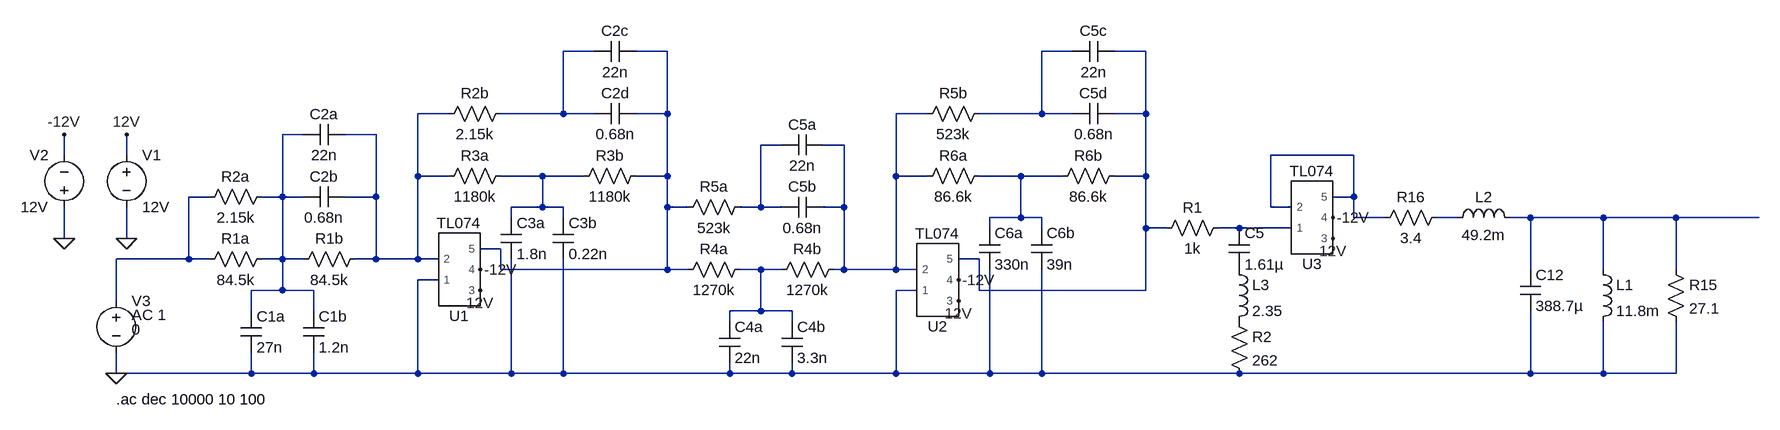
[diagram p0: schematic dual_full_lt_pyle_notch_tl074.asc]
dual_full_lt_pyle_notch_tl074.asc, the LTspice schematic file:
Version 4
SHEET 1 1284 1184
WIRE -688 224 -736 224
WIRE -576 224 -624 224
WIRE 48 224 0 224
WIRE 160 224 112 224
WIRE -912 320 -960 320
WIRE -736 320 -736 224
WIRE -736 320 -832 320
WIRE -688 320 -736 320
WIRE -576 320 -576 224
WIRE -576 320 -624 320
WIRE -176 320 -224 320
WIRE 0 320 0 224
WIRE 0 320 -96 320
WIRE 48 320 0 320
WIRE 160 320 160 224
WIRE 160 320 112 320
WIRE -1136 352 -1168 352
WIRE -1024 352 -1072 352
WIRE -400 368 -432 368
WIRE -304 368 -336 368
WIRE -1504 384 -1504 352
WIRE -1408 384 -1408 352
WIRE 480 384 352 384
WIRE -960 416 -960 320
WIRE -912 416 -960 416
WIRE -768 416 -832 416
WIRE -704 416 -768 416
WIRE -576 416 -576 320
WIRE -576 416 -624 416
WIRE -224 416 -224 320
WIRE -176 416 -224 416
WIRE -32 416 -96 416
WIRE 32 416 -32 416
WIRE 160 416 160 320
WIRE 160 416 112 416
WIRE -1280 448 -1312 448
WIRE -1168 448 -1168 352
WIRE -1168 448 -1200 448
WIRE -1136 448 -1168 448
WIRE -1024 448 -1024 352
WIRE -1024 448 -1072 448
WIRE 480 448 480 384
WIRE 480 448 448 448
WIRE -768 464 -768 416
WIRE -768 464 -816 464
WIRE -736 464 -768 464
WIRE -576 464 -576 416
WIRE -544 464 -576 464
WIRE -432 464 -432 368
WIRE -432 464 -464 464
WIRE -400 464 -432 464
WIRE -304 464 -304 368
WIRE -304 464 -336 464
WIRE 352 464 352 384
WIRE 384 464 352 464
WIRE -816 480 -816 464
WIRE -736 480 -736 464
WIRE -32 480 -32 416
WIRE -32 480 -80 480
WIRE 0 480 -32 480
WIRE 480 480 480 448
WIRE 528 480 480 480
WIRE 640 480 608 480
WIRE 752 480 720 480
WIRE 864 480 752 480
WIRE 976 480 864 480
WIRE 1104 480 976 480
WIRE -80 496 -80 480
WIRE 0 496 0 480
WIRE 160 496 160 416
WIRE 192 496 160 496
WIRE 304 496 272 496
WIRE 384 496 304 496
WIRE -1504 512 -1504 464
WIRE -1408 512 -1408 464
WIRE -832 528 -864 528
WIRE -1312 544 -1312 448
WIRE -1312 544 -1424 544
WIRE -1280 544 -1312 544
WIRE -1168 544 -1168 448
WIRE -1168 544 -1200 544
WIRE -1136 544 -1168 544
WIRE -1024 544 -1024 448
WIRE -1024 544 -1056 544
WIRE -960 544 -960 416
WIRE -960 544 -1024 544
WIRE -928 544 -960 544
WIRE -96 544 -128 544
WIRE -832 560 -832 528
WIRE -576 560 -576 464
WIRE -576 560 -832 560
WIRE -544 560 -576 560
WIRE -432 560 -464 560
WIRE -400 560 -432 560
WIRE -304 560 -304 464
WIRE -304 560 -320 560
WIRE -224 560 -224 416
WIRE -224 560 -304 560
WIRE -192 560 -224 560
WIRE 752 560 752 480
WIRE 864 560 864 480
WIRE 976 560 976 480
WIRE -928 576 -960 576
WIRE -1168 592 -1168 544
WIRE -1168 592 -1216 592
WIRE -1120 592 -1168 592
WIRE -192 592 -224 592
WIRE -96 592 -96 544
WIRE 160 592 160 496
WIRE 160 592 -96 592
WIRE -1424 608 -1424 544
WIRE -1216 624 -1216 592
WIRE -1120 624 -1120 592
WIRE -432 624 -432 560
WIRE -432 624 -480 624
WIRE -384 624 -432 624
WIRE -480 640 -480 624
WIRE -384 640 -384 624
WIRE -1424 720 -1424 688
WIRE -1216 720 -1216 688
WIRE -1216 720 -1424 720
WIRE -1120 720 -1120 688
WIRE -1120 720 -1216 720
WIRE -960 720 -960 576
WIRE -960 720 -1120 720
WIRE -816 720 -816 544
WIRE -816 720 -960 720
WIRE -736 720 -736 544
WIRE -736 720 -816 720
WIRE -480 720 -480 704
WIRE -480 720 -736 720
WIRE -384 720 -384 704
WIRE -384 720 -480 720
WIRE -224 720 -224 592
WIRE -224 720 -384 720
WIRE -80 720 -80 560
WIRE -80 720 -224 720
WIRE 0 720 0 560
WIRE 0 720 -80 720
WIRE 304 720 0 720
WIRE 752 720 752 624
WIRE 752 720 304 720
WIRE 864 720 864 640
WIRE 864 720 752 720
WIRE 976 720 976 640
WIRE 976 720 864 720
FLAG -1424 720 0
FLAG -1408 352 12V
FLAG -1504 352 -12V
FLAG -1504 512 0
FLAG -1408 512 0
FLAG -864 592 12V
FLAG -864 560 -12V
FLAG -128 608 12V
FLAG -128 576 -12V
FLAG 448 512 12V
FLAG 448 480 -12V
SYMBOL res -1184 528 R90
WINDOW 0 0 56 VBottom 2
WINDOW 3 32 56 VTop 2
SYMATTR InstName R1a
SYMATTR Value 84.5k
SYMBOL res -1040 528 R90
WINDOW 0 0 56 VBottom 2
WINDOW 3 32 56 VTop 2
SYMATTR InstName R1b
SYMATTR Value 84.5k
SYMBOL res -1184 432 R90
WINDOW 0 0 56 VBottom 2
WINDOW 3 32 56 VTop 2
SYMATTR InstName R2a
SYMATTR Value 2.15k
SYMBOL cap -1072 432 R90
WINDOW 0 0 32 VBottom 2
WINDOW 3 32 32 VTop 2
SYMATTR InstName C2b
SYMATTR Value 0.68n
SYMBOL cap -1232 624 R0
SYMATTR InstName C1a
SYMATTR Value 27n
SYMBOL res -816 400 R90
WINDOW 0 0 56 VBottom 2
WINDOW 3 32 56 VTop 2
SYMATTR InstName R3a
SYMATTR Value 1180k
SYMBOL cap -832 480 R0
SYMATTR InstName C3a
SYMATTR Value 1.8n
SYMBOL res -608 400 R90
WINDOW 0 0 56 VBottom 2
WINDOW 3 32 56 VTop 2
SYMATTR InstName R3b
SYMATTR Value 1180k
SYMBOL res -816 304 R90
WINDOW 0 0 56 VBottom 2
WINDOW 3 32 56 VTop 2
SYMATTR InstName R2b
SYMATTR Value 2.15k
SYMBOL cap -624 304 R90
WINDOW 0 0 32 VBottom 2
WINDOW 3 32 32 VTop 2
SYMATTR InstName C2d
SYMATTR Value 0.68n
SYMBOL cap 736 560 R0
SYMATTR InstName C12
SYMATTR Value 388.7µ
SYMBOL ind 848 544 R0
SYMATTR InstName L1
SYMATTR Value 11.8m
SYMBOL res 960 544 R0
SYMATTR InstName R15
SYMATTR Value 27.1
SYMBOL res 624 464 R90
WINDOW 0 0 56 VBottom 2
WINDOW 3 32 56 VTop 2
SYMATTR InstName R16
SYMATTR Value 3.4
SYMBOL voltage -1424 592 R0
WINDOW 123 24 38 Left 2
WINDOW 39 0 0 Left 0
WINDOW 3 24 60 Left 2
SYMATTR Value2 AC 1
SYMATTR Value 0
SYMATTR InstName V3
SYMBOL voltage -1408 368 R0
SYMATTR InstName V1
SYMATTR Value 12V
SYMBOL voltage -1504 480 R180
WINDOW 0 24 96 Left 2
WINDOW 3 24 16 Left 2
SYMATTR InstName V2
SYMATTR Value 12V
SYMBOL cap -1136 624 R0
SYMATTR InstName C1b
SYMATTR Value 1.2n
SYMBOL cap -1072 336 R90
WINDOW 0 0 32 VBottom 2
WINDOW 3 32 32 VTop 2
SYMATTR InstName C2a
SYMATTR Value 22n
SYMBOL cap -624 208 R90
WINDOW 0 0 32 VBottom 2
WINDOW 3 32 32 VTop 2
SYMATTR InstName C2c
SYMATTR Value 22n
SYMBOL cap -752 480 R0
SYMATTR InstName C3b
SYMATTR Value 0.22n
SYMBOL ind 624 496 R270
WINDOW 0 32 56 VTop 2
WINDOW 3 5 56 VBottom 2
SYMATTR InstName L2
SYMATTR Value 49.2m
SYMBOL res 288 480 R90
WINDOW 0 0 56 VBottom 2
WINDOW 3 32 56 VTop 2
SYMATTR InstName R1
SYMATTR Value 1k
SYMBOL cap 288 496 R0
SYMATTR InstName C5
SYMATTR Value 1.61µ
SYMBOL ind 288 544 R0
SYMATTR InstName L3
SYMATTR Value 2.35
SYMBOL res 288 624 R0
SYMATTR InstName R2
SYMATTR Value 262
SYMBOL res -448 544 R90
WINDOW 0 0 56 VBottom 2
WINDOW 3 32 56 VTop 2
SYMATTR InstName R4a
SYMATTR Value 1270k
SYMBOL res -304 544 R90
WINDOW 0 0 56 VBottom 2
WINDOW 3 32 56 VTop 2
SYMATTR InstName R4b
SYMATTR Value 1270k
SYMBOL res -448 448 R90
WINDOW 0 0 56 VBottom 2
WINDOW 3 32 56 VTop 2
SYMATTR InstName R5a
SYMATTR Value 523k
SYMBOL cap -336 448 R90
WINDOW 0 0 32 VBottom 2
WINDOW 3 32 32 VTop 2
SYMATTR InstName C5b
SYMATTR Value 0.68n
SYMBOL cap -496 640 R0
SYMATTR InstName C4a
SYMATTR Value 22n
SYMBOL res -80 400 R90
WINDOW 0 0 56 VBottom 2
WINDOW 3 32 56 VTop 2
SYMATTR InstName R6a
SYMATTR Value 86.6k
SYMBOL cap -96 496 R0
SYMATTR InstName C6a
SYMATTR Value 330n
SYMBOL res 128 400 R90
WINDOW 0 0 56 VBottom 2
WINDOW 3 32 56 VTop 2
SYMATTR InstName R6b
SYMATTR Value 86.6k
SYMBOL res -80 304 R90
WINDOW 0 0 56 VBottom 2
WINDOW 3 32 56 VTop 2
SYMATTR InstName R5b
SYMATTR Value 523k
SYMBOL cap 112 304 R90
WINDOW 0 0 32 VBottom 2
WINDOW 3 32 32 VTop 2
SYMATTR InstName C5d
SYMATTR Value 0.68n
SYMBOL cap -400 640 R0
SYMATTR InstName C4b
SYMATTR Value 3.3n
SYMBOL cap -336 352 R90
WINDOW 0 0 32 VBottom 2
WINDOW 3 32 32 VTop 2
SYMATTR InstName C5a
SYMATTR Value 22n
SYMBOL cap 112 208 R90
WINDOW 0 0 32 VBottom 2
WINDOW 3 32 32 VTop 2
SYMATTR InstName C5c
SYMATTR Value 22n
SYMBOL cap -16 496 R0
SYMATTR InstName C6b
SYMATTR Value 39n
SYMBOL AutoGenerated/TL074 -896 560 M180
SYMATTR InstName U1
SYMBOL AutoGenerated/TL074 -160 576 M180
SYMATTR InstName U2
SYMBOL AutoGenerated/TL074 416 480 M180
SYMATTR InstName U3
TEXT -1424 760 Left 2 !.ac dec 10000 10 100

The netlist it stands for:
* dual_full_lt_pyle_notch_tl074.asc
R1a N007 N012 84.5k
R1b N005 N007 84.5k
R2a N007 N012 2.15k
C2b N005 N007 0.68n
C1a N007 0 27n
R3a N010 N005 1180k
C3a N010 0 1.8n
R3b N002 N010 1180k
R2b N001 N005 2.15k
C2d N002 N001 0.68n
C12 N014 0 388.7µ
L1 N014 0 11.8m
R15 N014 0 27.1
R16 N013 N009 3.4
V3 N012 0 0 AC 1
V1 12V 0 12V
V2 0 -12V 12V
C1b N007 0 1.2n
C2a N005 N007 22n
C2c N002 N001 22n
C3b N010 0 0.22n
L2 N013 N014 49.2m
R1 N015 N004 1k
C5 N015 P001 1.61µ
L3 P001 P002 2.35
R2 P002 0 262
R4a N016 N002 1270k
R4b N006 N016 1270k
R5a N008 N002 523k
C5b N006 N008 0.68n
C4a N016 0 22n
R6a N011 N006 86.6k
C6a N011 0 330n
R6b N004 N011 86.6k
R5b N003 N006 523k
C5d N004 N003 0.68n
C4b N016 0 3.3n
C5a N006 N008 22n
C5c N004 N003 22n
C6b N011 0 39n
XU1 0 N005 12V -12V N002 TL074  ; pins 1 2 3 4 5
XU2 0 N006 12V -12V N004 TL074  ; pins 1 2 3 4 5
XU3 N015 N009 12V -12V N009 TL074  ; pins 1 2 3 4 5
.ac dec 10000 10 100
.lib /Users/sujit/Documents/UNIVERSITY/3rd Year Project/git/3rd-year-project/OpenLoopDesign/Simulations/LTspice/PylePLPW6D/Datasheet/TL074.301
.backanno
.end